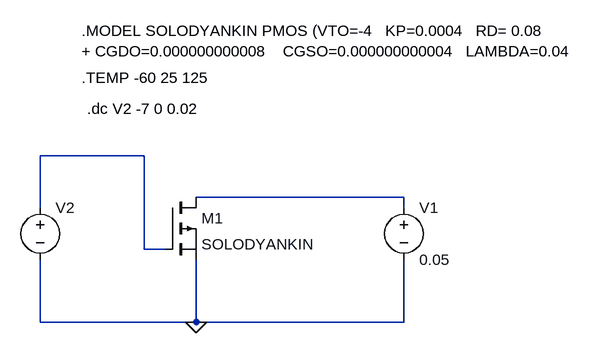
[diagram p0: schematic Draft2_1.asc]
Draft2_1.asc, the LTspice schematic file:
Version 4
SHEET 1 880 680
WIRE -64 128 -224 128
WIRE 336 192 16 192
WIRE -224 208 -224 128
WIRE 336 208 336 192
WIRE -64 272 -64 128
WIRE -32 272 -64 272
WIRE -224 384 -224 288
WIRE 16 384 16 288
WIRE 16 384 -224 384
WIRE 336 384 336 288
WIRE 336 384 16 384
FLAG 16 384 0
SYMBOL pmos -32 192 R0
SYMATTR InstName M1
SYMATTR Value SOLODYANKIN
SYMBOL voltage 336 192 R0
WINDOW 123 0 0 Left 2
WINDOW 39 0 0 Left 2
SYMATTR InstName V1
SYMATTR Value 0.05
SYMBOL voltage -224 192 R0
SYMATTR InstName V2
SYMATTR Value ""
TEXT -160 -64 Left 2 !.MODEL SOLODYANKIN PMOS (VTO=-4   KP=0.0004   RD= 0.08 \n+ CGDO=0.000000000008    CGSO=0.000000000004   LAMBDA=0.04
TEXT -160 8 Left 2 !.TEMP -60 25 125
TEXT -152 56 Left 2 !.dc V2 -7 0 0.02

The netlist it stands for:
* Draft2_1.asc
M1 N002 N001 0 0 SOLODYANKIN
V1 N002 0 0.05
V2 N001 0
.model NMOS NMOS
.model PMOS PMOS
.lib standard.mos
.MODEL SOLODYANKIN PMOS (VTO=-4   KP=0.0004   RD= 0.08
+ CGDO=0.000000000008    CGSO=0.000000000004   LAMBDA=0.04
.TEMP -60 25 125
.dc V2 -7 0 0.02
.backanno
.end